# Altium schematic sheet Host.SchDoc
size A
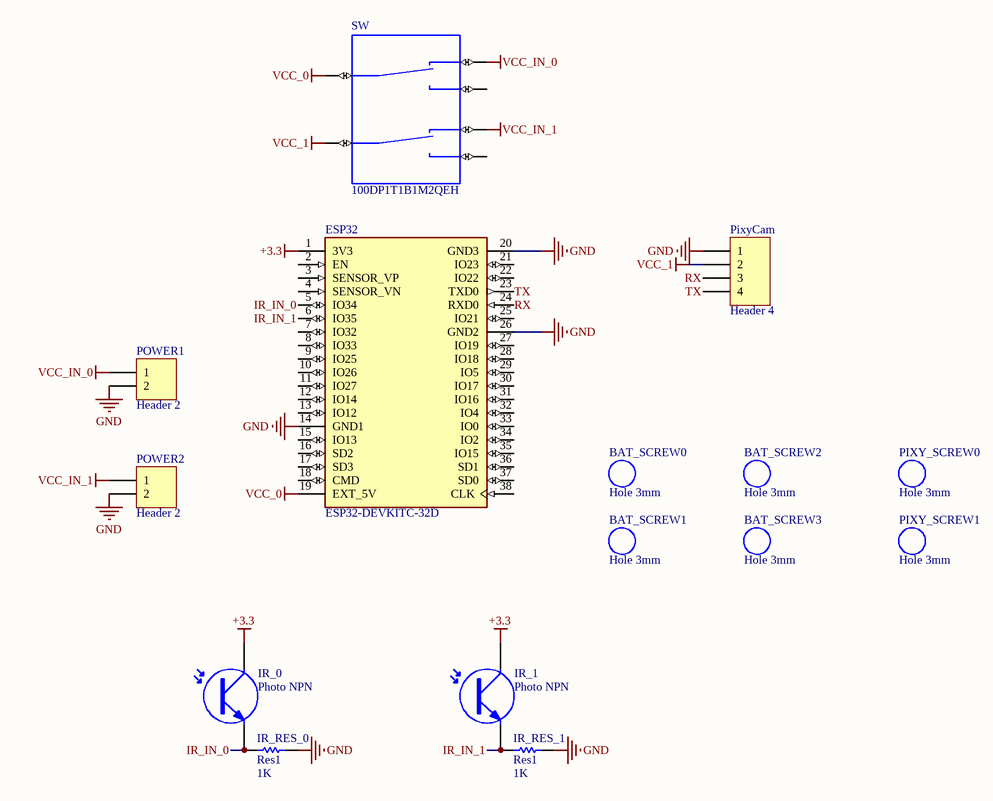
[diagram p0: Host.SchDoc]

## Parts
BAT_SCREW0  Hole 3mm  [Hole 3mm]
BAT_SCREW1  Hole 3mm  [Hole 3mm]
BAT_SCREW2  Hole 3mm  [Hole 3mm]
BAT_SCREW3  Hole 3mm  [Hole 3mm]
ESP32  ESP32-DEVKITC-32D  [ESP32-NODEMCU]
IR_0  Photo NPN  [IR_HEAD]
IR_1  Photo NPN  [IR_HEAD]
IR_RES_0  Res1  value 1K  [AXIAL-0.3]
IR_RES_1  Res1  value 1K  [AXIAL-0.3]
PIXY_SCREW0  Hole 3mm  [Hole 3mm]
PIXY_SCREW1  Hole 3mm  [Hole 3mm]
PixyCam  Header 4  [HDR1X4]
POWER1  Header 2  [HDR1X2]
POWER2  Header 2  [HDR1X2]
SW  100DP1T1B1M2QEH  [100DP1T1B1M2QEH]

## Nets
+3.3: ESP32.1(3V3) IR_0.1(C) IR_1.1(C)
GND: ESP32.14(GND1) ESP32.20(GND3) ESP32.26(GND2) IR_RES_0.2 IR_RES_1.2 PixyCam.1 POWER1.2 POWER2.2
VCC_0: ESP32.19(EXT_5V) SW.5
VCC_1: PixyCam.2 SW.2
VCC_IN_0: POWER1.1 SW.6
VCC_IN_1: POWER2.1 SW.3
IR_IN_0: ESP32.5(IO34) IR_0.3(E) IR_RES_0.1
IR_IN_1: ESP32.6(IO35) IR_1.3(E) IR_RES_1.1
RX: ESP32.24(RXD0) PixyCam.3
TX: ESP32.23(TXD0) PixyCam.4

Not connected (* = marked no-connect by the designer): ESP32 2(EN) 3(SENSOR_VP) 4(SENSOR_VN) 7(IO32) 8(IO33) 9(IO25) 10(IO26) 11(IO27) 12(IO14) 13(IO12) 15(IO13) 16(SD2) 17(SD3) 18(CMD) 21(IO23) 22(IO22) 25(IO21) 27(IO19) 28(IO18) 29(IO5) 30(IO17) 31(IO16) 32(IO4) 33(IO0) 34(IO2) 35(IO15) 36(SD1) 37(SD0) 38(CLK); SW 1 4

## Library data of the parts
ESP32 = ESP32-DEVKITC-32D: - Transceiver; 802.11 b/g/n _Wi-Fi, WiFi, WLAN_, BluetoothÂ® Smart Ready 4.x Dual Mode For Use With ESP-WROOM-32; MF: Espressif Systems; Package: None; Price: None; Availability: Unavailable; MP: ESP32-DEVKITC-32D; SnapEDA_Link: https://www.snapeda.com/parts/ESP32-DEVKITC-32D/Espressif%20Systems/view-part/2777395/?ref=snap; Value: *
IR_0 IR_1 = Photo NPN: NPN Phototransistor; Published: 24-Mar-1999; LatestRevisionDate: 17-Jul-2002; LatestRevisionNote: Re-released for DXP Platform.; PackageReference: TO-220_A; Publisher: Altium Limited; Code_JEDEC: TO-220-AC
IR_RES_0 IR_RES_1 = Res1: Resistor; Published: 8-Jun-2000; LatestRevisionDate: 17-Jul-2002; LatestRevisionNote: Re-released for DXP Platform.; PackageReference: AXIAL-0.3; Publisher: Altium Limited; PackageDescription: Axial Device, Thru-Hole; 2 Leads; 0.3 in Pin Spacing
PixyCam = Header 4: Header, 4-Pin; LatestRevisionDate: 17-Jul-2002; LatestRevisionNote: Re-released for DXP Platform.; Publisher: Altium Limited
POWER1 POWER2 = Header 2: Header, 2-Pin; LatestRevisionDate: 17-Jul-2002; LatestRevisionNote: Re-released for DXP Platform.; Publisher: Altium Limited
SW = 100DP1T1B1M2QEH: Toggle Switch DPDT Panel Mount; MF: E-Switch; Value: *; MP: 100DP1T1B1M2QEH; SnapEDA_Link: https://www.snapeda.com/parts/100DP1T1B1M2QEH/E-Switch/view-part/423930/?ref=snap; Availability: Unavailable; Package: None; Price: None